# Altium schematic sheet Exemplo.SchDoc
size A4; SheetNumber: 1; SheetTotal: 1; SPICEModelCacheLQILWZSI: <root> / <DocumentId>LQILWZSI</DocumentId> / <CacheFrame Number="0"> / <Model Name="1n4004" Kind="MDL"> / <Text>*1N4004 MCE 8-16-95 / *400V 1A Si GenPurpose Diode pkg:DIODE0.4 1,2 / .MODEL 1N4004 D(IS=2.55E-9 RS=0.042 N=1.75 TT=5.76E-6 CJO=1.85E-11 / + VJ=0.75 M=0.333 BV=400 IBV=3.95E-5 )</Text> / </Model> / <Model Name="cap" Kind="MDL"> / <Text>*Default semiconductor capacitor / .MODEL CAP C()</Text> / </Model> / </CacheFrame> / </root>
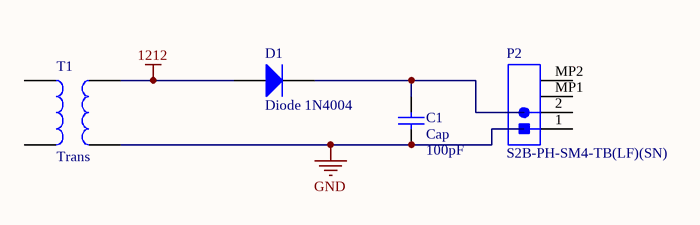
[diagram p0: Exemplo.SchDoc]

## Parts
C1  Cap  value 100pF  [RAD-0.3]
D1  Diode 1N4004  [DO-41]
P2  S2B-PH-SM4-TB(LF)(SN)  [JST- S2B-PH-SM4-TB(LF)(SN)-2_V]
T1  Trans  [TRANS]

## Nets
1212: D1.1(A) T1.3
GND: C1.1 T1.4
NetC1_2: C1.2 D1.2(K)

Not connected (* = marked no-connect by the designer): P2 1 2 MP1 MP2; T1 1 2

## Library data of the parts
C1 = Cap: Capacitor; Published: 8-Jun-2000; LatestRevisionDate: 17-Jul-2002; LatestRevisionNote: Re-released for DXP Platform.; PackageReference: RAD-0.3; Publisher: Altium Limited; PackageDescription: Radial Cap, Thru-Hole; 2 Leads; 0.3 in Pin Spacing
D1 = Diode 1N4004: 1 Amp General Purpose Rectifier; Published: 8-Jun-2000; LatestRevisionDate: 17-Jul-2002; LatestRevisionNote: Re-released for DXP Platform.; DatasheetVersion: 1998; PackageVersion: Aug-1999; PackageReference: DO-41; Publisher: Altium Limited; PackageDescription: Diode, Axial; Body 5.2 x 2.7 mm (LxDia. max), Lead Dia. 0.86 mm (max); Code_JEDEC: DO-204-AL; ComponentLink1Description: Manufacturer Link; ComponentLink1URL: http://www.fairchildsemi.com/; ComponentLink2Description: Datasheet; ComponentLink2URL: http://www.fairchildsemi.com/ds/1N%2F1N4001.pdf
P2 = CMP-002-00031-2: Male Header, Pitch 2 mm, 1 x 2 Position, Height 5.5 mm, -25 to 85 degC, RoHS, Tape and Reel; Manufacturer: JST; Package Reference: S2B-PH-SM4-TB(LF)(SN)-2; Mounting Technology: SM; Manufacturer URL: http://www.jst.com/home2.html; Package Description: Male Header, Pitch 2 mm, 1 x 2 Position, Height 5.5 mm; Max Operating Temperature: 85°C; Case/Package: S2B-PH-SM4-TB(LF)(SN)-2; Datasheet URL: http://www.jst-mfg.com/product/pdf/eng/ePH.pdf; Connector Type: Header; RoHS Compliant: Unknown; Datasheet Version: Dec-12; Gender: Male; Min Operating Temperature: -25°C
T1 = Trans: Transformer; Published: 24-Mar-1999; LatestRevisionDate: 08-Jul-2005; LatestRevisionNote: Mech Layer 1 removed.; PackageReference: TRANS; Publisher: Altium Limited; PackageDescription: Transformer; 4 Leads